# EAGLE design astronaut_mainboard_3 (EAGLE 7.5.0)
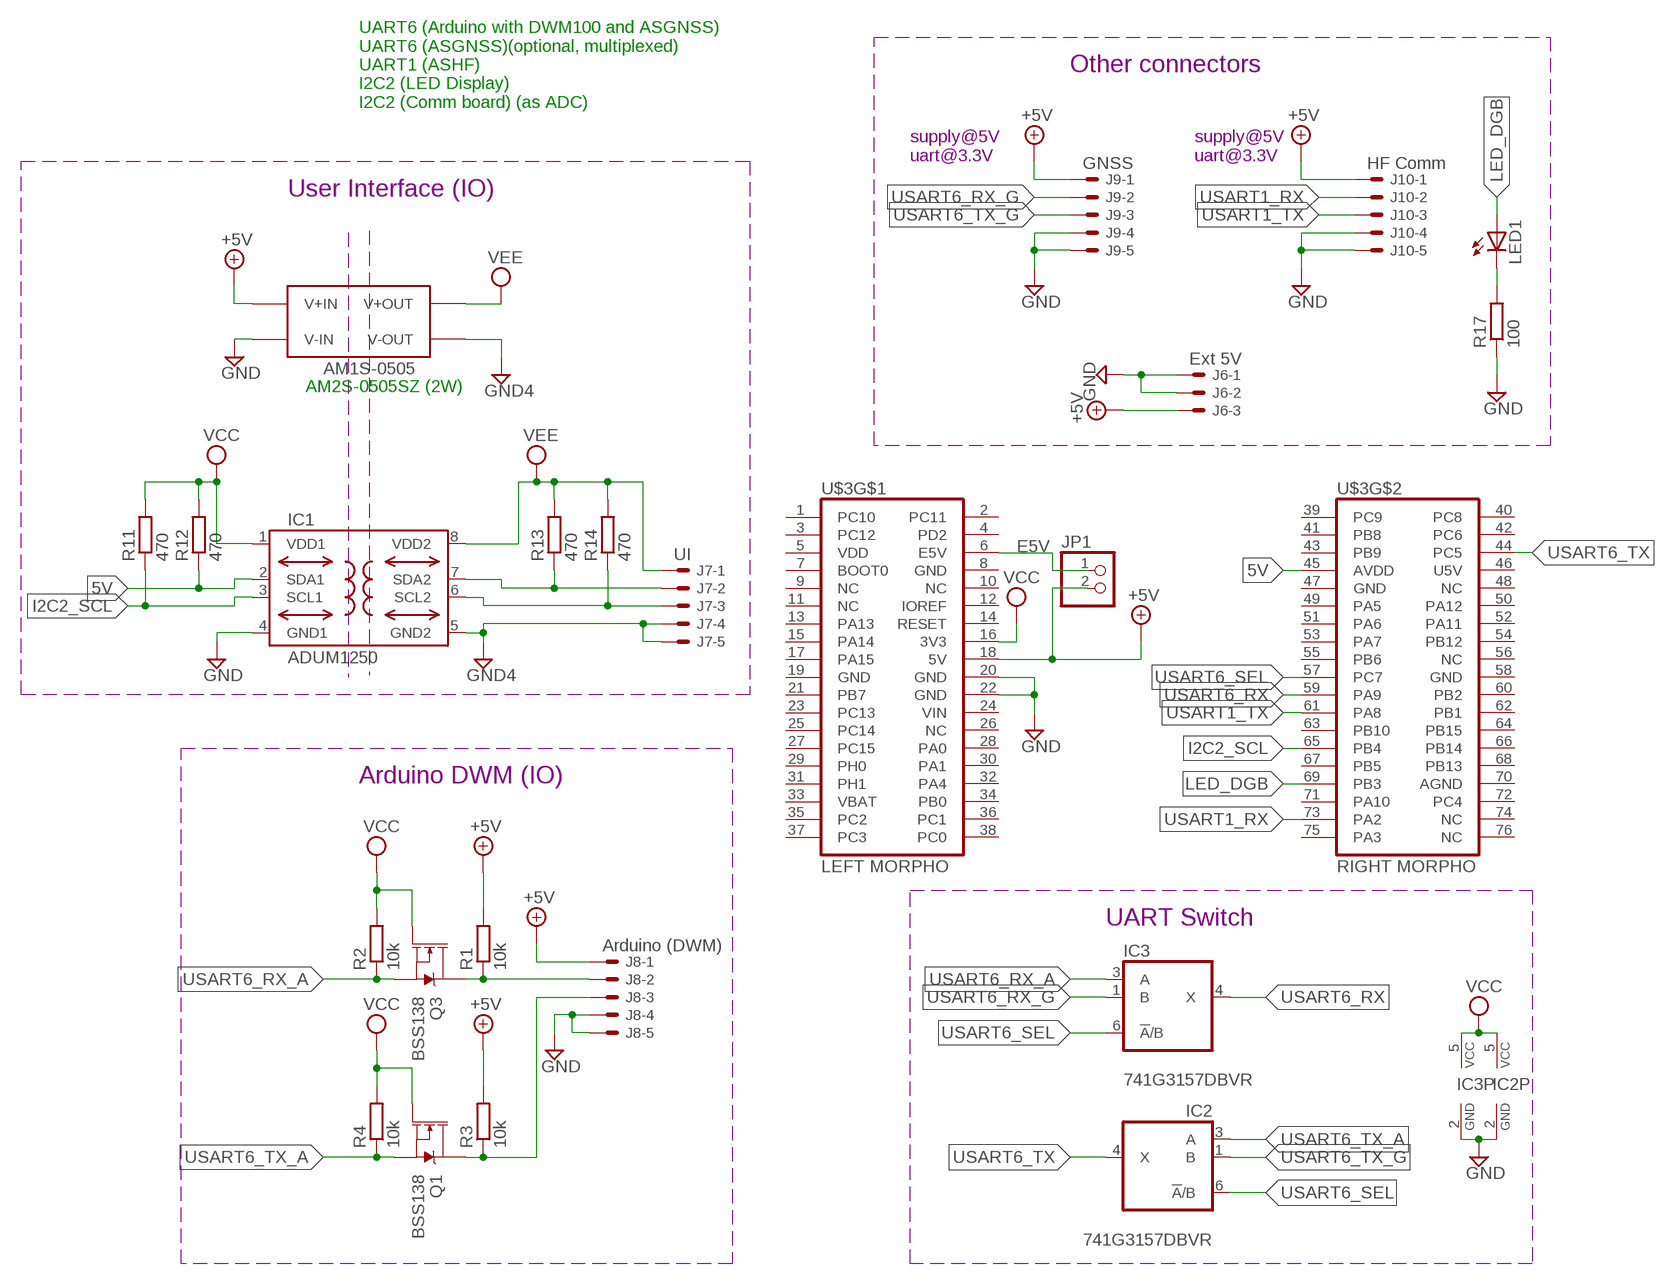
[diagram p0: schematic, sheet 1]

## Parts
IC1  ADUM1250  [SO8-COOL]
IC2  741G3157DBVR  [DBV_R-PDSO-G6]
IC3  741G3157DBVR  [DBV_R-PDSO-G6]
J6  Ext 5V  22-05-7038-03  [7395-03]
J7  UI  22-05-7058-05  [7395-05]
J8  Arduino (DWM)  22-05-7058-05  [7395-05]
J9  GNSS  22-05-7058-05  [7395-05]
J10  HF Comm  22-05-7058-05  [7395-05]
JP1  PINHD-1X2  [1X02]
LED1  LEDSML1206  [SML1206]
Q1  BSS138  MOSFET-NCH-AO3404A  [SOT23-3]
Q3  BSS138  MOSFET-NCH-AO3404A  [SOT23-3]
R1  10k  R-EU_R0805  [R0805]
R2  10k  R-EU_R0805  [R0805]
R3  10k  R-EU_R0805  [R0805]
R4  10k  R-EU_R0805  [R0805]
R11  470  R-EU_R0805  [R0805]
R12  470  R-EU_R0805  [R0805]
R13  470  R-EU_R0805  [R0805]
R14  470  R-EU_R0805  [R0805]
R17  100  R-EU_R0805  [R0805]
U$2  AM1S-0505  [SIP4]
U$3  NUCLEO_F411RE_MORPHO  [MORPHO_HEADERS]

## Nets
5V: IC1.2(SDA1) R12.1 U$3.45(AVDD)
+5V: J6.3 J8.1 J9.1 J10.1 JP1.2 R1.2 R3.2 U$2.P$2(V+IN) U$3.18(5V)
ARDU_RX: J8.2 Q3.3(D) R1.1
ARDU_TX: J8.3 Q1.3(D) R3.1
E5V: JP1.1 U$3.6(E5V)
GND: IC1.4(GND1) IC2.2(GND) IC3.2(GND) J6.1 J6.2 J8.4 J8.5 J9.4 J9.5 J10.4 J10.5 R17.1 U$2.P$1(V-IN) U$3.20(GND) U$3.22(GND)
GND4: IC1.5(GND2) J7.4 J7.5 U$2.P$3(V-OUT)
I2C2_SCL: IC1.3(SCL1) R11.1 U$3.65(PB4)
LED_DGB: LED1.A U$3.69(PB3)
N$3: LED1.C R17.2
UI_SCL: IC1.6(SCL2) J7.3 R14.1
UI_SDA: IC1.7(SDA2) J7.2 R13.1
USART1_RX: J10.2 U$3.73(PA2)
USART1_TX: J10.3 U$3.61(PA8)
USART6_RX: IC3.4(X) U$3.59(PA9)
USART6_RX_A: IC3.3(A) Q3.2(S) R2.1
USART6_RX_G: IC3.1(B) J9.2
USART6_SEL: IC2.6(!A!/B) IC3.6(!A!/B) U$3.57(PC7)
USART6_TX: IC2.4(X) U$3.44(PC5)
USART6_TX_A: IC2.3(A) Q1.2(S) R4.1
USART6_TX_G: IC2.1(B) J9.3
VCC: IC1.1(VDD1) IC2.5(VCC) IC3.5(VCC) Q1.1(G) Q3.1(G) R2.2 R4.2 R11.2 R12.2 U$3.16(3V3)
VEE: IC1.8(VDD2) J7.1 R13.2 R14.2 U$2.P$4(V+OUT)
Unconnected: U$3.1(PC10) U$3.2(PC11) U$3.3(PC12) U$3.4(PD2) U$3.7(BOOT0) U$3.9(NC) U$3.10(NC) U$3.11(NC) U$3.12(IOREF) U$3.13(PA13) U$3.14(RESET) U$3.15(PA14) U$3.17(PA15) U$3.21(PB7) U$3.23(PC13) U$3.25(PC14) U$3.26(NC) U$3.27(PC15) U$3.28(PA0) U$3.29(PH0) U$3.30(PA1) U$3.31(PH1) U$3.32(PA4) U$3.34(PB0) U$3.35(PC2) U$3.36(PC1) U$3.37(PC3) U$3.38(PC0) U$3.39(PC9) U$3.40(PC8) U$3.41(PB8) U$3.42(PC6) U$3.43(PB9) U$3.48(NC) U$3.49(PA5) U$3.50(PA12) U$3.51(PA6) U$3.52(PA11) U$3.53(PA7) U$3.54(PB12) U$3.55(PB6) U$3.56(NC) U$3.60(PB2) U$3.62(PB1) U$3.63(PB10) U$3.64(PB15) U$3.66(PB14) U$3.67(PB5) U$3.68(PB13) U$3.71(PA10) U$3.72(PC4) U$3.74(NC) U$3.75(PA3) U$3.76(NC)

## Notes on the sheet
- Other connectors
- UART6 (Arduino with DWM100 and ASGNSS)
  UART6 (ASGNSS)(optional, multiplexed)
  UART1 (ASHF)
  I2C2 (LED Display)
  I2C2 (Comm board) (as ADC)
- supply@5V 
  uart@3.3V
- supply@5V 
  uart@3.3V
- User Interface (IO)
- AM2S-0505SZ (2W)
- Arduino DWM (IO)
- UART Switch

## Power pins joined to a net without a drawn wire
AGND: U$3.70(AGND)
GND: U$3.8(GND) U$3.19(GND) U$3.47(GND) U$3.58(GND)
U5V: U$3.46(U5V)
VBAT: U$3.33(VBAT)
VDD: U$3.5(VDD)
VIN: U$3.24(VIN)

## Library data of the parts
IC1 = analog-devices-3:ADUM1250: Hot Swappable, Dual I2C Isolators Source: http://www.analog.com/static/imported-files/data_sheets/ADUM1250_1251.pdf
IC2 IC3 = 74xx-little-de:74*1G3157: Single-Pole, Double-Throw Analog Switch Source: http://focus.ti.com/lit/ds/symlink/sn74lvc1g3157.pdf
J6 = EP_molex_6410_7395:22-?-03: CONNECTOR wire to board 2.54 mm (.1 inch) pitch header
J7-J10 = EP_molex_6410_7395:22-?-05: CONNECTOR wire to board 2.54 mm (.1 inch) pitch header
JP1 = pinhead:PINHD-1X2: PIN HEADER
LED1 = led:LED: LED OSRAM: - CHIPLED LG R971, LG N971, LY N971, LG Q971, LY Q971, LO R971, LY R971 LH N974, LH R974 LS Q976, LO Q976, LY Q976 LO Q996 - Hyper CHIPLED LW Q18S LB Q993, LB Q99A, LB R99A - SideLED LS A670, LO A670, LY A670, LG A670, LP A670 LB A673, LV A673, LT A673, LW A673 LH A674 LY A675 LS A676, LA A676, LO A676, LY A676, LW A676 LS A679, LY A679, LG A679 - Hyper Micro SIDELED® LS Y876, LA Y876, LO Y876, LY Y876 LT Y87S - SmartLED LW L88C, LW L88S LB L89C, LB L89S, LG L890 LS L89K, LO L89K, LY L89K LS L896, LA L896, LO L896, LY L896 - TOPLED LS T670, LO T670, LY T670, LG T670, LP T670 LSG T670, LSP T670, LSY T670, LOP T670, LYG T670 LG T671, LOG T671, LSG T671 LB T673, LV T673, LT T673, LW T673 LH T674 LS T676, LA T676, LO T676, LY T676, LB T676, LH T676, LSB T676, LW T676 LB T67C, LV T67C, LT T67C, LS T67K, LO T67K, LY T67K, LW E67C LS E67B, LA E67B, LO E67B, LY E67B, LB E67C, LV E67C, LT E67C LW T67C LS T679, LY T679, LG T679 LS T770, LO T770, LY T770, LG T770, LP T770 LB T773, LV T773, LT T773, LW T773 LH T774 LS E675, LA E675, LY E675, LS T675 LS T776, LA T776, LO T776, LY T776, LB T776 LHGB T686 LT T68C, LB T68C - Hyper Mini TOPLED® LB M676 - Mini TOPLED Santana® LG M470 LS M47K, LO M47K, LY M47K Source: http://www.osram.convergy.de LUXEON: - LUMILED® LXK2-PW12-R00, LXK2-PW12-S00, LXK2-PW14-U00, LXK2-PW14-V00 LXK2-PM12-R00, LXK2-PM12-S00, LXK2-PM14-U00 LXK2-PE12-Q00, LXK2-PE12-R00, LXK2-PE12-S00, LXK2-PE14-T00, LXK2-PE14-U00 LXK2-PB12-K00, LXK2-PB12-L00, LXK2-PB12-M00, LXK2-PB14-N00, LXK2-PB14-P00, LXK2-PB14-Q00 LXK2-PR12-L00, LXK2-PR12-M00, LXK2-PR14-Q00, LXK2-PR14-R00 LXK2-PD12-Q00, LXK2-PD12-R00, LXK2-PD12-S00 LXK2-PH12-R00, LXK2-PH12-S00 LXK2-PL12-P00, LXK2-PL12-Q00, LXK2-PL12-R00 Source: www.luxeon.com KINGBRIGHT: KA-3528ASYC Source: www.kingbright.com
Q1 Q3 = SparkFun-DiscreteSemi:MOSFET-NCH: N-channel MOSFETs Voltage controlled devices that allow control of high current outputs. SparkFun Products: SparkFun OpenScale <https://www.sparkfun.com/products/13261> SparkFun Digital Sandbox <https://www.sparkfun.com/products/12651> SparkFun Monster Moto Shield <https://www.sparkfun.com/products/10182> SparkFun MOSFET Power Controller <https://www.sparkfun.com/products/11214>; PROD_ID: TRANS-12988; VALUE: 5.8A/30V/35mΩ
R1-R4 R11-R14 R17 = rcl:R-EU_: RESISTOR, European symbol
U$2 = am1s:AM1S-0505
U$3 = stm32_nucleo_shield:NUCLEO_F411RE_MORPHO

## Board
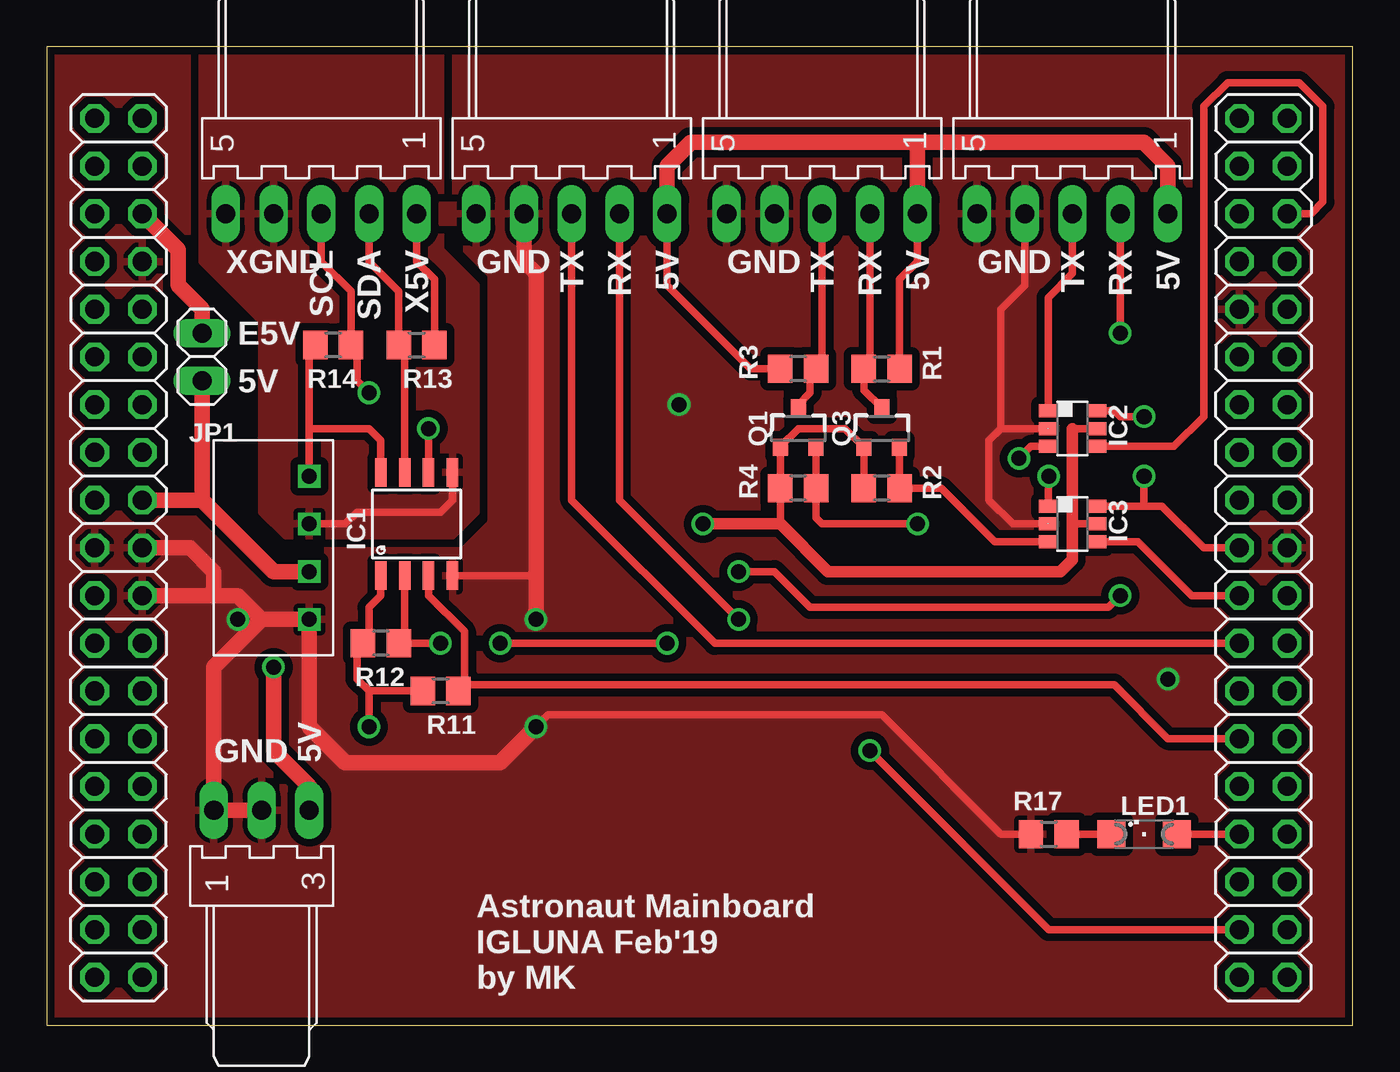
[diagram p1: board, top side]
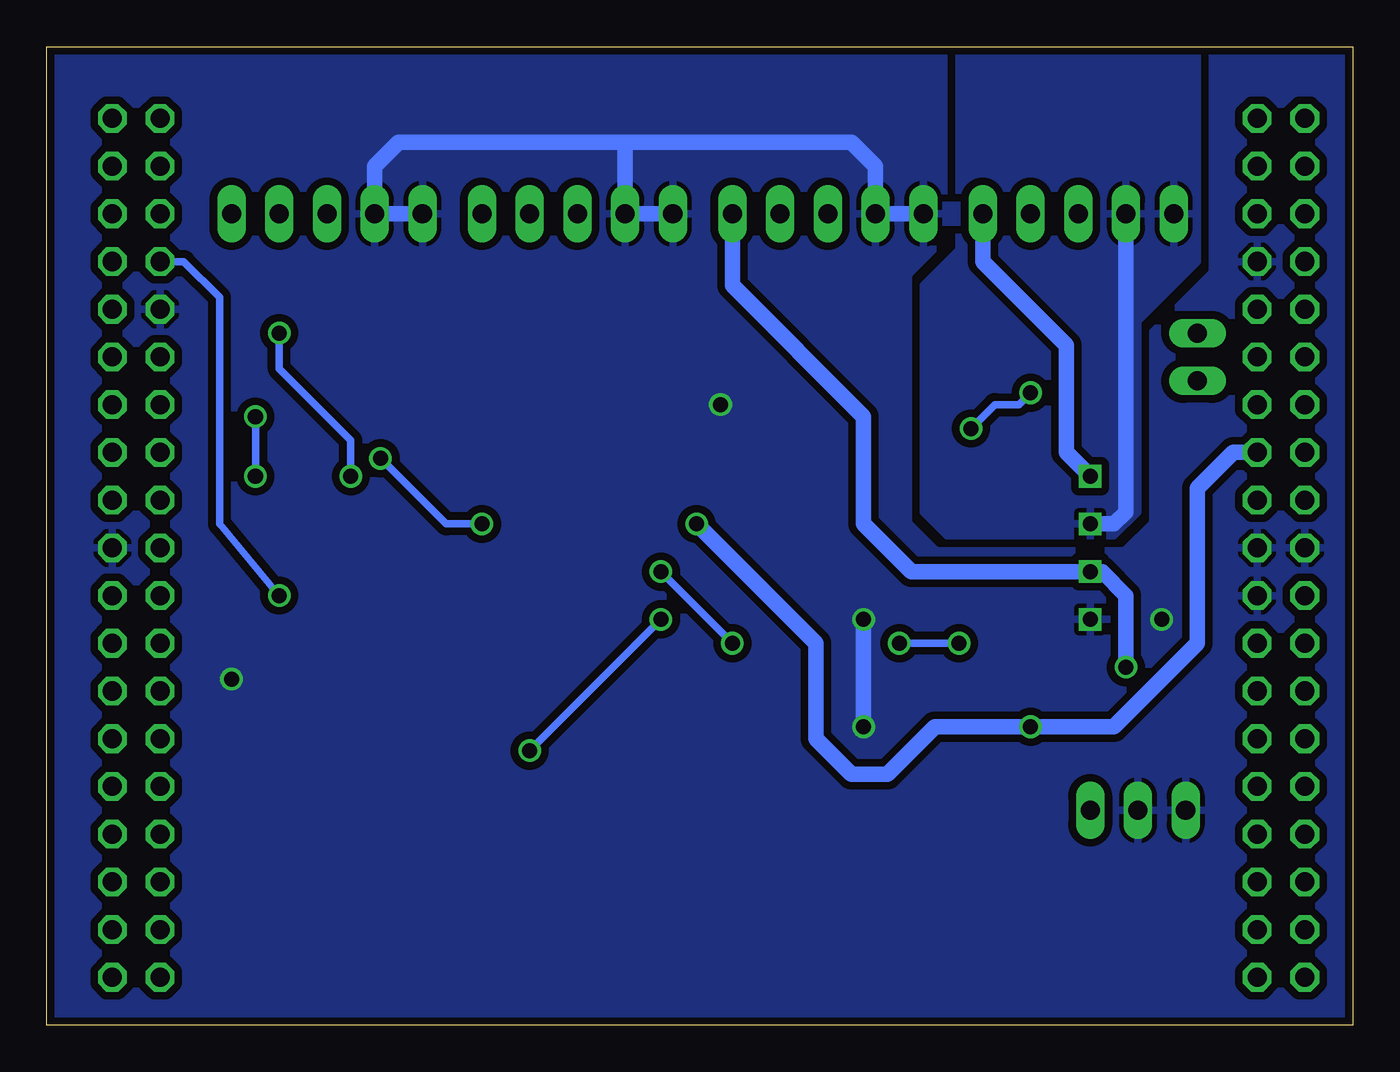
[diagram p2: board, bottom side, seen from below]

Size 69.52 x 52.06 mm. Coordinates in mm from the lower left corner, seen from the top.
Outline: 0,0 69.52,0 69.52,52.06 0,52.06 0,0
Copper layers (1*16): Top 0.035mm / dielectric 1.5mm / Bottom 0.035mm
Design rules "jlcpcb_rules": minimum track width 5mil, minimum drill 0.2mm, track to track 5mil, track to pad 5mil, pad to pad 5mil, via to via 5mil, smd to smd 5mil, copper to edge 0.2mm, drill to drill 12mil, minimum pad ring 3mil, minimum via ring 3mil, stop-mask expansion 4mil, vias tented up to drill 0mil, thermal gap 10mil

### Footprints (pad centres in the part's own frame; a part is rotated, then mirrored left to right if it is on the bottom)
SO8-COOL = smd 0.61 x 1.524: 1 -1.905,-2.743; 2 -0.635,-2.743; 3 0.635,-2.743; 4 1.905,-2.743; 5 1.905,2.743; 6 0.635,2.743; 7 -0.635,2.743; 8 -1.905,2.743
DBV_R-PDSO-G6 = smd 0.69 x 0.99: 1 -0.95,-1.29; 2 0,-1.29; 3 0.95,-1.29; 4 0.95,1.3; 5 0,1.3; 6 -0.95,1.3
7395-03 = drill 1.016 long: 1 2.54,0; 2 0,0; 3 -2.54,0
7395-05 = drill 1.016 long: 1 5.08,0; 2 2.54,0; 3 0,0; 4 -2.54,0; 5 -5.08,0
1X02 = drill 1.016 long: 1 -1.27,0; 2 1.27,0
SML1206 = smd 1.5 x 1.5: A 1.75,0; C -1.75,0
SOT23-3 = smd 0.8 x 0.9: 1 -0.95,-1; 2 0.95,-1; 3 0,1.1
R0805 = smd 1.3 x 1.5: 1 -0.95,0; 2 0.95,0
SIP4 = drill 0.8 square: P$1 1.27,0; P$2 3.81,0; P$3 6.35,0; P$4 8.89,0
MORPHO_HEADERS = drill 1.016 octagon: 1 -31.75,22.86; 2 -29.21,22.86; 3 -31.75,20.32; 4 -29.21,20.32; 5 -31.75,17.78; 6 -29.21,17.78; 7 -31.75,15.24; 8 -29.21,15.24; 9 -31.75,12.7; 10 -29.21,12.7; 11 -31.75,10.16; 12 -29.21,10.16; 13 -31.75,7.62; 14 -29.21,7.62; 15 -31.75,5.08; 16 -29.21,5.08; 17 -31.75,2.54; 18 -29.21,2.54; 19 -31.75,0; 20 -29.21,0; 21 -31.75,-2.54; 22 -29.21,-2.54; 23 -31.75,-5.08; 24 -29.21,-5.08; 25 -31.75,-7.62; 26 -29.21,-7.62; 27 -31.75,-10.16; 28 -29.21,-10.16; 29 -31.75,-12.7; 30 -29.21,-12.7; 31 -31.75,-15.24; 32 -29.21,-15.24; 33 -31.75,-17.78; 34 -29.21,-17.78; 35 -31.75,-20.32; 36 -29.21,-20.32; 37 -31.75,-22.86; 38 -29.21,-22.86; 39 29.21,22.86; 40 31.75,22.86; 41 29.21,20.32; 42 31.75,20.32; 43 29.21,17.78; 44 31.75,17.78; 45 29.21,15.24; 46 31.75,15.24; 47 29.21,12.7; 48 31.75,12.7; 49 29.21,10.16; 50 31.75,10.16; 51 29.21,7.62; 52 31.75,7.62; 53 29.21,5.08; 54 31.75,5.08; 55 29.21,2.54; 56 31.75,2.54; 57 29.21,0; 58 31.75,0; 59 29.21,-2.54; 60 31.75,-2.54; 61 29.21,-5.08; 62 31.75,-5.08; 63 29.21,-7.62; 64 31.75,-7.62; 65 29.21,-10.16; 66 31.75,-10.16; 67 29.21,-12.7; 68 31.75,-12.7; 69 29.21,-15.24; 70 31.75,-15.24; 71 29.21,-17.78; 72 31.75,-17.78; 73 29.21,-20.32; 74 31.75,-20.32; 75 29.21,-22.86; 76 31.75,-22.86

### Placement (x,y rotation side)
IC1  19.68,26.67 0 top
IC2  54.61,31.75 270 top
IC3  54.61,26.67 270 top
J6  11.43,11.43 180 top
J7  14.61,43.18 0 top
J8  41.27,43.18 0 top
J9  54.61,43.18 0 top
J10  27.94,43.18 0 top
JP1  8.26,35.56 270 top
LED1  58.42,10.16 0 top
Q1  40,31.75 0 top
Q3  44.45,31.75 0 top
R1  44.45,34.92 0 top
R2  44.45,28.57 180 top
R3  40,34.92 180 top
R4  40,28.57 180 top
R11  20.96,17.78 180 top
R12  17.78,20.32 180 top
R13  19.68,36.2 0 top
R14  15.24,36.2 180 top
R17  53.34,10.16 0 top
U$2  13.97,20.32 90 top
U$3  34.29,25.4 0 top

### Tracks (layer width: path | path; a pad name or v marks a point on that pad's centre or on a via)
5V  (via drill 0.8)
  Top 0.406: R12.1 19.05,20.64 IC1.2 19.05,20.32 v20.96,20.32 | v24.13,20.32 v33.02,20.32 | v36.83,24.13 38.73,24.13 40.64,22.23 56.51,22.23 v57.15,22.86
  Bottom 0.406: v20.96,20.32 v24.13,20.32 | v33.02,20.32 v36.83,24.13 | v57.15,22.86 60.32,26.67 60.32,38.73 62.23,40.64 U$3.45
+5V  (via drill 0.8)
  Top 0.406: R1.2 45.4,39.69 46.35,40.64 J8.1 | J10.1 33.02,39.37 37.46,34.92 R3.2
  Top 0.813: U$3.18 8.26,27.94 | U$2.P$2 12.07,24.13 8.26,27.94 | J9.1 59.69,45.72 58.42,46.99 46.35,46.99 | J8.1 46.35,46.99 | 46.35,46.99 34.29,46.99 33.02,45.72 J10.1 | JP1.2 8.26,27.94 | v12.07,19.05 12.07,14.61 13.97,12.7 J6.3
  Bottom 0.813: v12.07,19.05 12.07,22.86 13.34,24.13 U$2.P$2 23.5,24.13 26.04,26.67 26.04,32.38 33.02,39.37 J10.1
ARDU_RX
  Top 0.406: J8.2 43.81,35.24 R1.1 43.5,33.8 Q3.3
ARDU_TX
  Top 0.406: J8.3 41.27,35.24 R3.1 40.64,35.24 40.64,33.66 40,33.02 Q1.3
E5V
  Top 0.813: U$3.6 6.99,41.27 6.99,39.37 8.26,38.1 JP1.1
GND  (via drill 0.8)
  Top 0.406: IC3.2 51.43,26.67 50.16,27.94 50.16,31.11 50.8,31.75 | 50.8,31.75 IC2.2 | 50.8,31.75 50.8,38.1 52.07,39.37 J9.4 | IC1.4 26.04,23.93 | v26.04,15.88 26.67,16.51 44.45,16.51 50.8,10.16 R17.1
  Top 0.813: U$3.22 8.89,22.86 | v26.04,15.88 24.13,13.97 15.88,13.97 13.97,15.88 U$2.P$1 11.43,21.59 | J10.4 25.4,40.64 26.04,40.01 26.04,23.93 v26.04,21.59 | U$3.20 7.62,25.4 8.89,24.13 8.89,22.86 | 8.89,22.86 10.16,22.86 11.43,21.59 | 11.43,21.59 8.89,19.05 J6.1 J6.2
  Bottom 0.813: 38.73,46.99 50.8,46.99 52.07,45.72 J9.4 J9.5 | 38.73,46.99 26.67,46.99 25.4,45.72 J10.4 J10.5 | 38.73,46.99 J8.4 J8.5 | v26.04,15.88 v26.04,21.59
  other vias: 33.65,33.02 59.69,18.41 10.16,21.59
  pour Top (isolate 0.406, rank 6): 0,52.07 69.85,52.07 69.85,0 0,0
  pour Bottom (isolate 0.406, rank 6): 0,52.07 69.85,52.07 69.85,0 0,0
GND4
  Top 0.406: IC1.5 21.59,27.94 20.96,27.3 16.51,27.3 15.88,26.67 U$2.P$3
  Bottom 0.813: J7.4 12.07,27.3 12.7,26.67 U$2.P$3
  pour Top (isolate 0.406): 8.26,52.07 20.96,52.07 20.96,41.27 22.86,39.37 22.86,27.3 21.59,26.04 12.7,26.04 11.43,27.3 11.43,37.47 8.26,40.64
  pour Bottom (isolate 0.406): 20.96,52.07 20.96,41.27 22.86,39.37 22.86,27.3 21.59,26.04 12.7,26.04 11.43,27.3 11.43,37.47 8.26,40.64 8.26,52.07
I2C2_SCL
  Top 0.406: IC1.3 20.32,22.86 22.23,20.95 22.23,18.1 | 22.23,18.1 R11.1 | 22.23,18.1 56.83,18.1 59.69,15.24 U$3.65
LED_DGB
  Top 0.406: U$3.69 LED1.A
N$3
  Top 0.406: LED1.C R17.2
UI_SCL  (via drill 0.8)
  Top 0.406: J7.3 14.61,40.64 16.19,39.05 R14.1 16.38,36.01 16.51,36.01 16.51,34.29 v17.14,33.66 | IC1.6 v20.32,31.75
  Bottom 0.406: v20.32,31.75 19.05,33.02 17.78,33.02 v17.14,33.66
UI_SDA
  Top 0.406: J7.2 17.14,40.64 18.73,39.05 R13.1 19.05,35.88 IC1.7
USART1_RX  (via drill 0.8)
  Top 0.406: U$3.73 53.34,5.08 v43.81,14.61 | v36.83,21.59 30.48,27.94 J10.2
  Bottom 0.406: v36.83,21.59 v43.81,14.61
USART1_TX
  Top 0.406: U$3.61 35.56,20.32 27.94,27.94 J10.3
USART6_RX
  Top 0.406: IC3.4 58.1,25.72 60.96,22.86 U$3.59
USART6_RX_A
  Top 0.406: Q3.2 R2.1 47.62,28.57 50.48,25.72 IC3.3
USART6_RX_G  (via drill 0.8)
  Top 0.406: J9.2 v57.15,36.83 | IC3.1 53.32,29.19 v53.34,29.21
  Bottom 0.406: v53.34,29.21 53.34,31.11 57.15,34.92 v57.15,36.83
USART6_SEL  (via drill 0.8)
  Top 0.406: IC3.6 58.42,27.62 | 58.42,27.62 59.38,27.62 61.59,25.4 U$3.57 | IC2.6 56.83,32.7 57.15,32.38 v58.42,32.38 | v58.42,29.21 58.42,27.62
  Bottom 0.406: v58.42,32.38 v58.42,29.21
USART6_TX
  Top 0.406: U$3.44 67.31,43.18 67.95,43.81 67.95,48.9 66.67,50.16 62.87,50.16 61.59,48.9 61.59,32.38 60.01,30.8 IC2.4
USART6_TX_A  (via drill 0.8)
  Top 0.406: Q1.2 R4.1 40.95,26.99 41.27,26.67 v46.35,26.67 | IC2.3 52.39,30.8 v51.75,30.16
  Bottom 0.406: v46.35,26.67 48.26,26.67 v51.75,30.16
USART6_TX_G
  Top 0.406: IC2.1 53.32,38.08 53.32,38.72 54.61,40.01 J9.3
VCC  (via drill 0.8)
  Top 0.406: IC1.1 17.78,22.86 17.14,22.23 17.14,20.64 R12.2 16.51,20 16.51,18.41 17.14,17.78 | R11.2 17.14,17.78 | R2.2 Q3.1 42.5,31.75 40,31.75 39.05,30.8 Q1.1 R4.2 39.05,26.67 | IC3.5 54.61,26.67 | 54.61,31.75 IC2.5 | 17.14,17.78 v17.14,15.88
  Top 0.61: 54.61,31.75 54.61,26.67 54.61,24.77 53.97,24.13 41.59,24.13 39.05,26.67 v34.92,26.67
  Bottom 0.813: U$3.16 6.35,30.48 8.26,28.57 8.26,20.32 12.7,15.88 v17.14,15.88 22.23,15.88 24.77,13.34 26.67,13.34 28.57,15.24 28.57,20.32 v34.92,26.67
VEE
  Top 0.406: IC1.8 17.78,31.11 17.14,31.75 13.97,31.75 | 13.97,31.75 U$2.P$4 | R13.2 20.64,39.69 19.68,40.64 J7.1 | R14.2 13.97,36.2 13.97,31.75
  Bottom 0.813: J7.1 19.68,40.64 15.24,36.2 15.24,30.48 U$2.P$4

### Text on the board
tNames: SCL | SDA | X5V | TX | RX | 5V | TX | RX | 5V | TX | RX | 5V | XGND | GND | GND | GND | E5V | 5V | . | . | . | GND | 5V | . | Astronaut Mainboard / IGLUNA Feb'19 / by MK